# EAGLE design RS232_NPN_PNP_FTDI_PowerSel (EAGLE 7.7.0)
RS232 Adapter using NPN and PNP Transistors
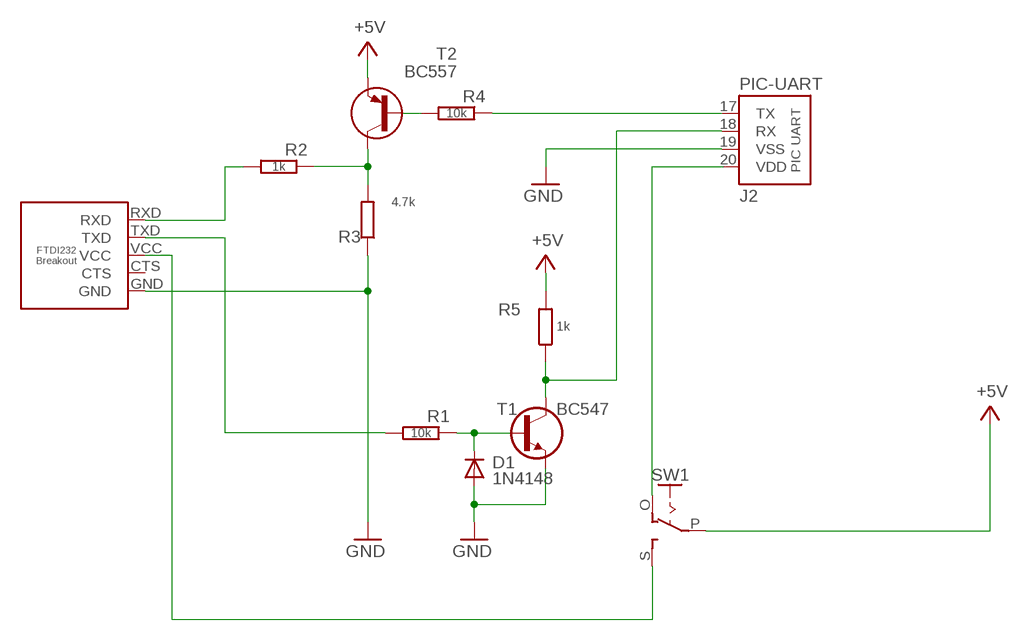
[diagram p0: schematic, sheet 1]

## Parts
D1  1N4148  1N414834-5  [DO34-5]
J1  FTDI232-BO-5P-L  [FTDI232-BO-5-L]
J2  PIC-UART  [PIC-UART]
R1  10k  R0202/5-V  [0202/5-V]
R2  1k  R0202/5  [0202/5]
R3  4.7k  R0202/5-V  [0202/5-V]
R4  10k  R0202/5  [0202/5]
R5  1k  R0202/5-V  [0202/5-V]
SW1  SL-SW-1P-2T-JPSW  [JPSW-1P2T]
T1  BC547  BC547CBE  [TO92-CBE]
T2  BC557  BC557CBE  [TO92-CBE]

## Nets
+5V: R5.2 SW1.P T2.E
GND: D1.A J1.GND J2.19(VSS) R3.1 T1.E
N$1: J2.18(RX) R5.1 T1.C
N$2: D1.C R1.1 T1.B
N$3: J1.TXD R1.2
N$4: J2.17(TX) R4.1
N$5: R4.2 T2.B
N$6: R2.1 R3.2 T2.C
N$7: J1.RXD R2.2
N$8: J1.VCC SW1.S
N$10: J2.20(VDD) SW1.O
Unconnected: J1.CTS

## Library data of the parts
D1 = d:1N4148
J1 = pinconn:FTDI232-BO-5P
J2 = pinconn:PIC-UART
R1-R5 = r:R: RESISTOR, European symbol
SW1 = sw:SL-SW-1P-2T
T1 = t:BC547
T2 = t:BC557

## Net classes
0 default: width 0.813 mm

## Board
RS232 Adapter using NPN and PNP Transistors
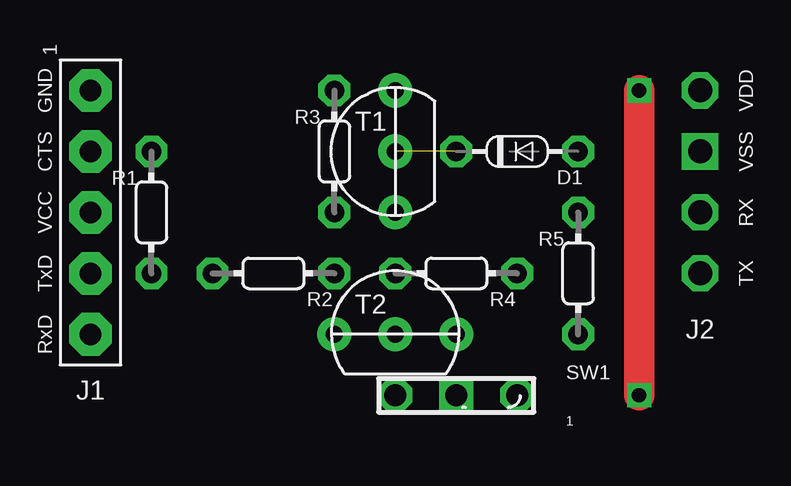
[diagram p1: board, top side]
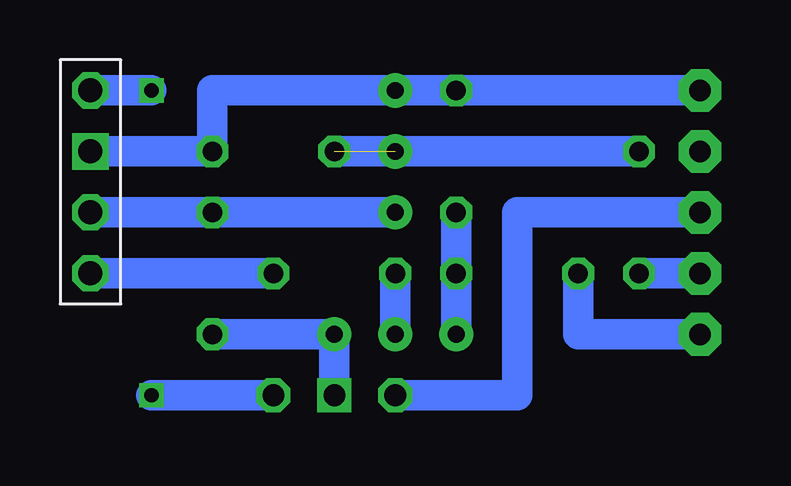
[diagram p2: board, bottom side, seen from below]

No outline drawn. Coordinates in mm, seen from the top.
Copper layers (1*16): Top 0.035mm / dielectric 1.5mm / Bottom 0.035mm
Design rules "default": minimum track width 10mil, minimum drill 24mil, track to track 8mil, track to pad 8mil, pad to pad 8mil, via to via 8mil, smd to smd 8mil, copper to edge 40mil, drill to drill 8mil, minimum pad ring 10mil, minimum via ring 8mil, stop-mask expansion 4mil, vias tented up to drill 0mil, thermal gap 10mil

### Footprints (pad centres in the part's own frame; a part is rotated, then mirrored left to right if it is on the bottom)
DO34-5 = drill 0.813 octagon: A 2.54,0; C -2.54,0
FTDI232-BO-5-L = drill 0.9 pad 1.778 octagon: CTS 0,2.54; GND 0,5.08; RXD 0,-5.08; TXD 0,-2.54; VCC 0,0
PIC-UART = drill 1 octagon: 17 0,0; 18 0,2.54; 20 0,7.62 | drill 1 square: 19 0,5.08
0202/5-V = drill 0.813 octagon: 1 0,2.54; 2 0,-2.54
0202/5 = drill 0.813 octagon: 1 -2.54,0; 2 2.54,0
JPSW-1P2T = drill 0.9 octagon: O -2.54,0; S 2.54,0 | drill 0.9 square: P 0,0
TO92-CBE = drill 0.7 pad 1.422: B 0,0; C 0,2.54; E 0,-2.54

### Placement (x,y rotation side)
D1  17.78,10.16 0 top
J1  0,7.62 0 top
J2  25.4,5.08 0 top
R1  10kΩ  [0202/5-V]  2.54,7.62 0 top
R2  1kΩ  [0202/5]  7.62,5.08 180 top
R3  4.7kΩ  [0202/5-V]  10.16,10.16 0 top
R4  10kΩ  [0202/5]  15.24,5.08 180 top
R5  1kΩ  [0202/5-V]  20.32,5.08 0 top
SW1  15.24,0 180 top
T1  12.7,10.16 180 top
T2  12.7,2.54 90 top

### Tracks (layer width: path | path; a pad name or v marks a point on that pad's centre or on a via)
+5V
  Bottom 1.27: SW1.P T2.E R5.2
GND
  Bottom 1.27: J2.19 D1.A 20.32,12.7 T1.E R3.1 J1.GND
N$1
  Bottom 1.27: J2.18 R5.1 T1.C
N$2  (1 unrouted)
  Bottom 1.27: D1.C R1.1
N$3
  Bottom 1.27: J1.TXD R1.2
N$4
  Bottom 1.27: R4.1 J2.17 21.59,5.08
N$5
  Bottom 1.27: R4.2 T2.B
N$6
  Bottom 1.27: R3.2 R2.1 T2.C
N$7
  Bottom 1.27: J1.RXD 5.08,2.54 R2.2
N$8
  Bottom 1.27: J1.VCC 7.62,7.62 7.62,0 SW1.S
N$10  (via drill 0.6)
  Top 1.27: v22.86,0 v22.86,12.7
  Bottom 1.27: SW1.O v22.86,0 | v22.86,12.7 J2.20